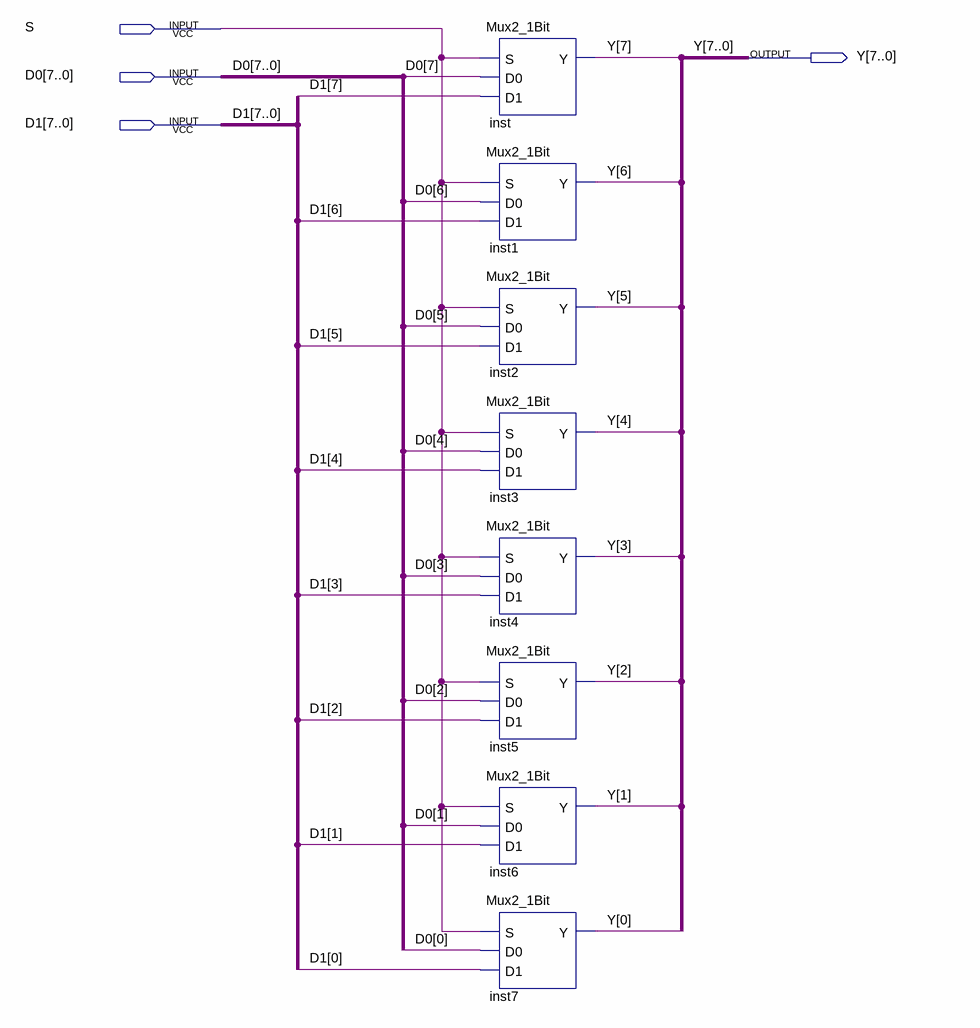
[diagram p0: schematic sheet]
// Quartus schematic Mux2_8Bit.bdf as structural Verilog: 8 symbols, 4 pins
module Mux2_8Bit (
  input  S,
  input  [7:0] D0,
  input  [7:0] D1,
  output [7:0] Y
);

  Mux2_1Bit inst (.S(S), .D0(D0[7]), .D1(D1[7]), .Y(Y[7]));
  Mux2_1Bit inst1 (.S(S), .D0(D0[6]), .D1(D1[6]), .Y(Y[6]));
  Mux2_1Bit inst2 (.S(S), .D0(D0[5]), .D1(D1[5]), .Y(Y[5]));
  Mux2_1Bit inst3 (.S(S), .D0(D0[4]), .D1(D1[4]), .Y(Y[4]));
  Mux2_1Bit inst4 (.S(S), .D0(D0[3]), .D1(D1[3]), .Y(Y[3]));
  Mux2_1Bit inst5 (.S(S), .D0(D0[2]), .D1(D1[2]), .Y(Y[2]));
  Mux2_1Bit inst6 (.S(S), .D0(D0[1]), .D1(D1[1]), .Y(Y[1]));
  Mux2_1Bit inst7 (.S(S), .D0(D0[0]), .D1(D1[0]), .Y(Y[0]));
endmodule
